# Altium project TP2_Flyback.PrjPcb
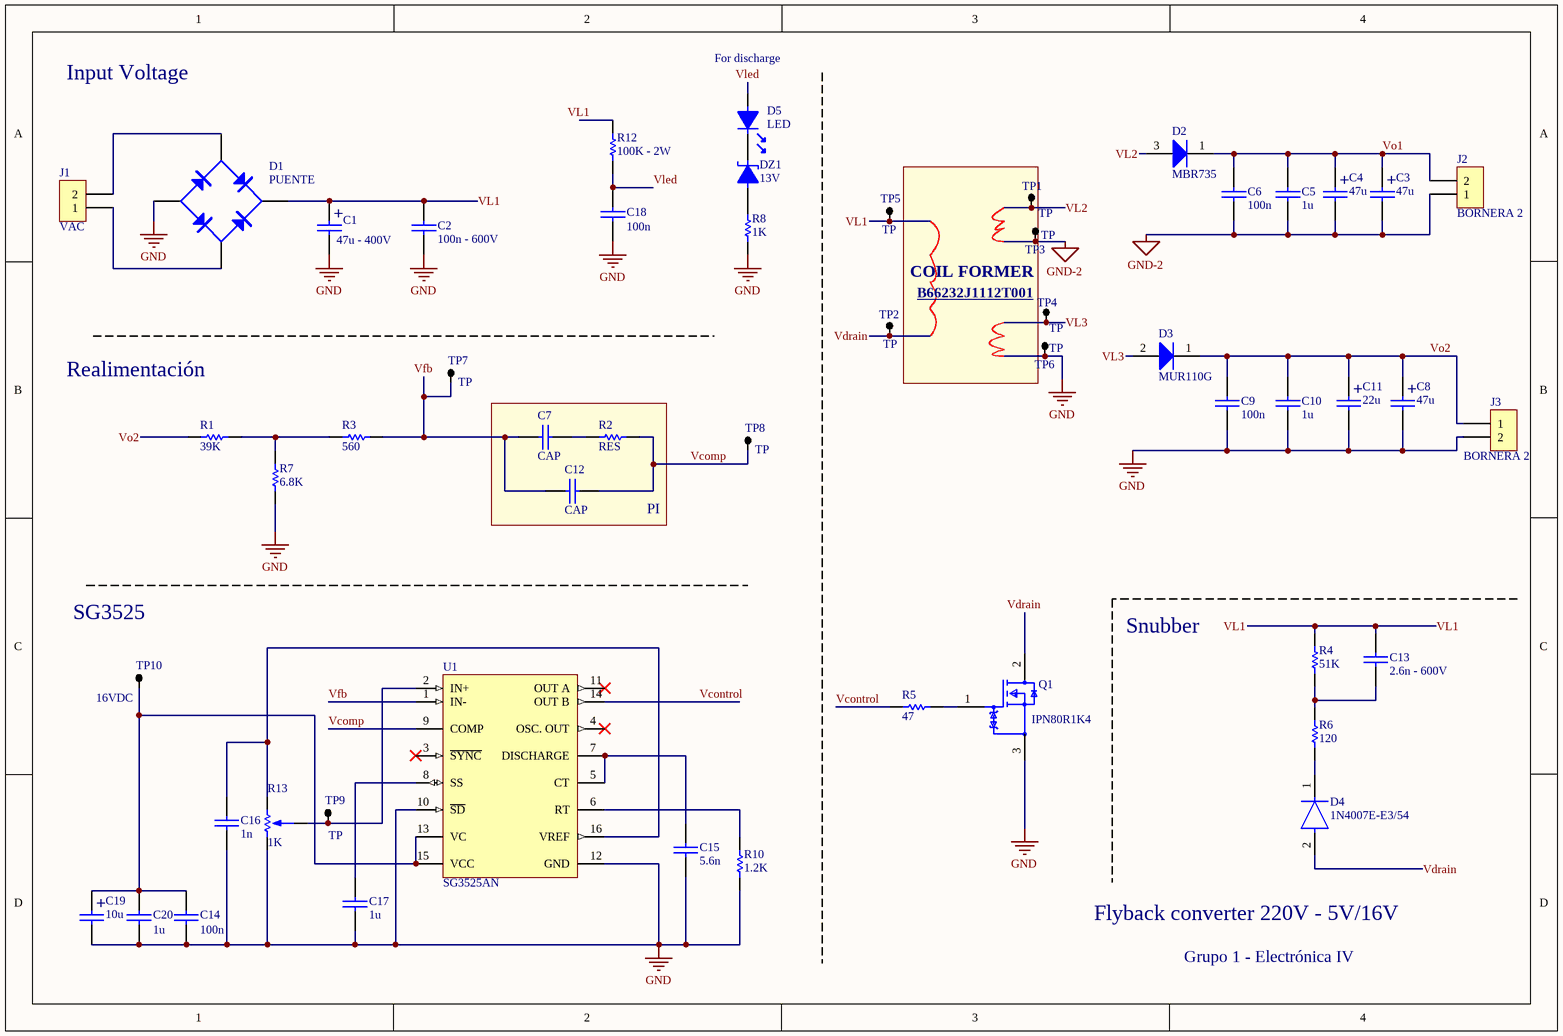
[diagram p0: Flyback_Schematic.SchDoc]
1 sheet, 52 parts. Net scope: global (net labels, ports and power ports of the same name join across sheets).
Board file: Flyback_PCB.PcbDoc

## Sheet Flyback_Schematic.SchDoc
size A4; SheetNumber: 1; SheetTotal: 1

### Parts
C1  47u - 400V  [CAP200RP2]
C2  100n - 600V  [CAP200]
C3  47u  [CAP100RP2]
C4  47u  [CAP100RP2]
C5  1u  [CAP100]
C6  100n  [CAP100]
C7  CAP  [0805]
C8  47u  [CAP100RP2]
C9  100n  [CAP100]
C10  1u  [CAP100]
C11  22u  [CAP100RP2]
C12  CAP  [0805]
C13  2.6n - 600V  [CAP200]
C14  100n  [CAP100]
C15  5.6n  [0805]
C16  1n  [0805]
C17  1u  [0805]
C18  100n  [0805]
C19  10u  [CAP100RP]
C20  1u  [CAP200]
D1  PUENTE  [PUENTE - W10M]
D2  MBR735  [ONSC-TO-220-2-221B-04_E]
D3  MUR110G  [ONSC-AXIAL_LEAD-2-59-10_P]
D4  1N4007E-E3/54  [FP-1N4007E-E3-54-MFG]
D5  LED  [LED3]
DZ1  13V  [DO41]
J1  VAC  [BORNERA2]
J2  BORNERA 2  [BORNERA2]
J3  BORNERA 2  [BORNERA2]
Q1  IPN80R1K4  [FP-PG-SOT223-3-MFG]
R1  39K  [0805]
R2  RES  [0805]
R3  560  [0805]
R4  51K  [RES600]
R5  47  [RES300]
R6  120  [RES400]
R7  6.8K  [0805]
R8  1K  [0805]
R10  1.2K  [0805]
R12  100K - 2W  [RES300]
R13  1K  [PRESET V]
TP1  TP  [TPTH]
TP2  TP  [TPTH]
TP3  TP  [TPTH]
TP4  TP  [TPTH]
TP5  TP  [TPTH]
TP6  TP  [TPTH]
TP7  TP  [TPTH]
TP8  TP  [TPTH]
TP9  TP  [TPTH]
TP10  16VDC  [TPTH]
U1  SG3525AN  [ONSC-PDIP-16-648-08_T]

### Blocks framed on the sheet
COIL FORMER: TP1 TP3
PI: C7 C12 R2

### Nets
GND: C1.2 C2.2 C8.2 C9.2 C10.2 C11.2 C14.1 C15.2 C16.1 C17.2 C18.1 C19.2 C20.1 D1.3(V-) J3.2 Q1.3(S) R7.2 R8.2 R10.2 R13.3 TP6.1 U1.10(~{SD}) U1.12(GND)
GND-2: C3.2 C4.2 C5.2 C6.2 J2.1 TP3.1
Vcomp: C12.2 R2.2 TP8.1 U1.9(COMP)
Vcontrol: R5.1 U1.14(OUT_B)
Vdrain: D4.2(A) Q1.2(D) TP2.1
Vfb: C7.2 C12.1 R3.1 TP7.1 U1.1(IN-)
VL1: C1.1 C2.1 C13.2 D1.1(V+) R4.2 R12.2 TP5.1
VL2: D2.3(A) TP1.1
VL3: D3.2(A) TP4.1
Vled: C18.2 D5.1 R12.1
Vo1: C3.1 C4.1 C5.1 C6.1 D2.1(K) J2.2
Vo2: C8.1 C9.1 C10.1 C11.1 D3.1(K) J3.1 R1.2
NetC7_1: C7.1 R2.1
NetC13_1: C13.1 R4.1 R6.2
NetC14_2: C14.2 C19.1 C20.2 TP10.1 U1.13(VC) U1.15(VCC)
NetC15_1: C15.1 U1.5(CT) U1.7(DISCHARGE)
NetC16_2: C16.2 R13.1 U1.16(VREF)
NetC17_1: C17.1 U1.8(SS)
NetD1_2: D1.2(AC) J1.2
NetD1_4: D1.4(AC) J1.1
NetD4_1: D4.1(C) R6.1
NetD5_2: D5.2 DZ1.2
NetDZ1_1: DZ1.1 R8.1
NetQ1_1: Q1.1(G) R5.2
NetR1_1: R1.1 R3.2 R7.1
NetR10_1: R10.1 U1.6(RT)
NetR13_2: R13.2 TP9.1 U1.2(IN+)

Not connected (* = marked no-connect by the designer): U1 3(~{SYNC})* 4(OSC._OUT)* 11(OUT_A)*

### Notes on the sheet
- Input Voltage
- (near D5) For discharge
- B66232J1112T001 <https://www.digikey.com/es/products/detail/epcos-tdk-electronics/B66232J1112T001/3914567>
- Realimentación
- (near TP10) SG3525
- Snubber
- Flyback converter 220V - 5V/16V
- Grupo 1 - Electrónica IV
- (in symbol CAPPOL) +

### Library data of the parts
C1 C4 C8 C11 C19 = CAPPOL
C2 C15-C18 = CAP
C3 = CAPPOL: Cerámico multicapa
C5 C6 C9 C10 = CAP: Cerámico multicapa
C13 = CAP: Tantalio
C14 C20 = CAP: -10u Electronlitico - 1u Multicapa - 0.1u ceramico
D2 = CMP-1055-00595-1: SWITCHMODE(TM) Power Rectifier, 2-Pin TO-220, Tube; Manufacturer: On Semiconductor; IFSM Max (A): 150; Configuration: Single; ComponentLink3URL: http://www.onsemi.com/pub_link/Collateral/BYW29-D.PDF; ComponentLink1URL: http://www.onsemi.com/; Mounting Technology: Through Hole; PartNumber: MBR735; PackageDescription: 2-Pin Flange Mount, Vertical Straight Lead, Body 9.97 x 4.44 mm, Pitch 5.08 mm; DatasheetVersion: Rev. 8; PackageReference: TO-220-2-221B-04_E; RoHS: FALSE; ComponentLink2URL: http://www.onsemi.cn/pub_link/Collateral/MBR735-D.PDF; PackageVersion: Rev. E; ComponentLink3Description: Package Specification; ComponentLink1Description: Manufacturer URL; Packing: Tube; ComponentLink2Description: Datasheet
D3 = CMP-0902-00129-1: SWITCHMODE(TM) Power Rectifier, 2-Pin Axial_Lead, Pb-Free, Bulk Bag; Manufacturer: On Semiconductor; PartNumber: MUR160G; IFSM Max (A): 35; VRRM Max (V): 600; Type: Ultrafast; PackageVersion: Rev. U, 02/2005; PackageDescription: 2-Pin, Axial Lead, Diameter 2.35 mm; RoHS: TRUE; ComponentLink3Description: Package Specification; ComponentLink3URL: http://www.onsemi.cn/pub_link/Collateral/59-10.PDF; Packing: Bulk Bag; ComponentLink1URL: http://www.onsemi.com/; ComponentLink1Description: Manufacturer URL; ComponentLink2Description: Datasheet; ComponentLink2URL: http://www.onsemi.com/pub_link/Collateral/MUR120-D.PDF; PackageReference: AXIAL_LEAD-2-59-10; Mounting Technology: Through Hole; DatasheetVersion: Rev. 12
D4 = CMP-02540-000087-1: DIODE GEN PURP 1KV 1A DO204AL; Peak Non-Repetitive Surge Current: 45A; Forward Voltage: 1.1V; Element Configuration: Single; Max Reverse Current: 5uA; Max Repetitive Reverse Voltage (Vrrm): 1kV; RoHS Compliant: Yes; Max Surge Current: 45A; Min Operating Temperature: -50°C; Radiation Hardening: No; Average Rectified Current: 1A; Series: -; Packaging: Tape and Reel; Contact Plating: Tin; Package Quantity: 5500; Max Reverse Voltage (DC): 1kV; Reverse Voltage: 1kV; Number of Pins: 2; Max Operating Temperature: 150°C; Case/Package: DO-41; Mount: Through Hole
DZ1 = DIODO ZENER
J1 = BORNERA 2
Q1 = CMP-00196-84309566-1: IPN80R1K4P7ATMA1 Power Transistor MOSFET N-Channel Enhancement 800V 4A 3-Pin SOT-223; On-State Resistance: 1.4Ω; Drain to Source Resistance: 1.2Ω; Number of Channels: 1; Turn-On Delay Time: 10ns; Power Dissipation: 7W; Gate to Source Voltage (Vgs): 20V; Turn-Off Delay Time: 40ns; Max Junction Temperature (Tj): 150°C; Packaging: Tape & Reel; Height: 1.8mm; RoHS: Non-Compliant; NexarPartId: 84309566; Lifecycle Status: Production; Max Operating Temperature: 150°C; Package Quantity: 3000; Continuous Drain Current (ID): 4A; Min Operating Temperature: -55°C; Drain to Source Breakdown Voltage: 800V; Drain to Source Voltage (Vdss): 800V; Schedule B: 8541290080, 8541290080
R1 R3-R8 R10 R12 = RES
R13 = PRESET
TP10 = TP
U1 = CMP-2000-07049-1: Pulse Width Modulator Control Circuit, 8 to 35 V, 0 to 70 degC, 16-Pin PDIP, RoHS, Tube; Manufacturer: ON Semiconductor; Voltage - Supply: 8V~35V; Number of Outputs: 2; Doubler: No; PWM Type: VoltageMode; Product Change Notification: ProductDiscontinuation27/Jun/2007; Duty Cycle: 49%; Frequency - Max: 400kHz; Other Names: SG3525ANOS; Category: IntegratedCircuits(ICs); Mounting Technology: ThroughHole; Package / Case: 16-DIP(0.300",7.62mm); Manufacturer URL: http://www.onsemi.com/; Buck: No; Family: PMIC-VoltageRegulators-DCDCSwitchingControllers; Operating Temperature: 0°C~70°C; Inverting: No; Package Reference: PDIP-16-648-08_T; Cuk: No; Boost: No; Package Description: 16-Pin Plastic Dual-In Line Package, Body 19.175 x 6.6 mm, Pitch 2.54 mm; Packaging: Tube; Standard Package: 25; Datasheet Version: Rev. 5, 01/2005; Datasheet URL: http://www.onsemi.cn/pub_link/Collateral/SG3525A-D.PDF; Divider: No; Isolated: No; Flyback: No